# Altium project PV Refridgerator.PrjPCB (part 2 of 2)

## Sheet RGB LED.SchDoc: RGB LED
size Letter; Date: 2017-02-06; DocumentNumber: 16; Revision: A; SheetNumber: 16; SheetTotal: 16; DesignedBy: Craig Comberbach
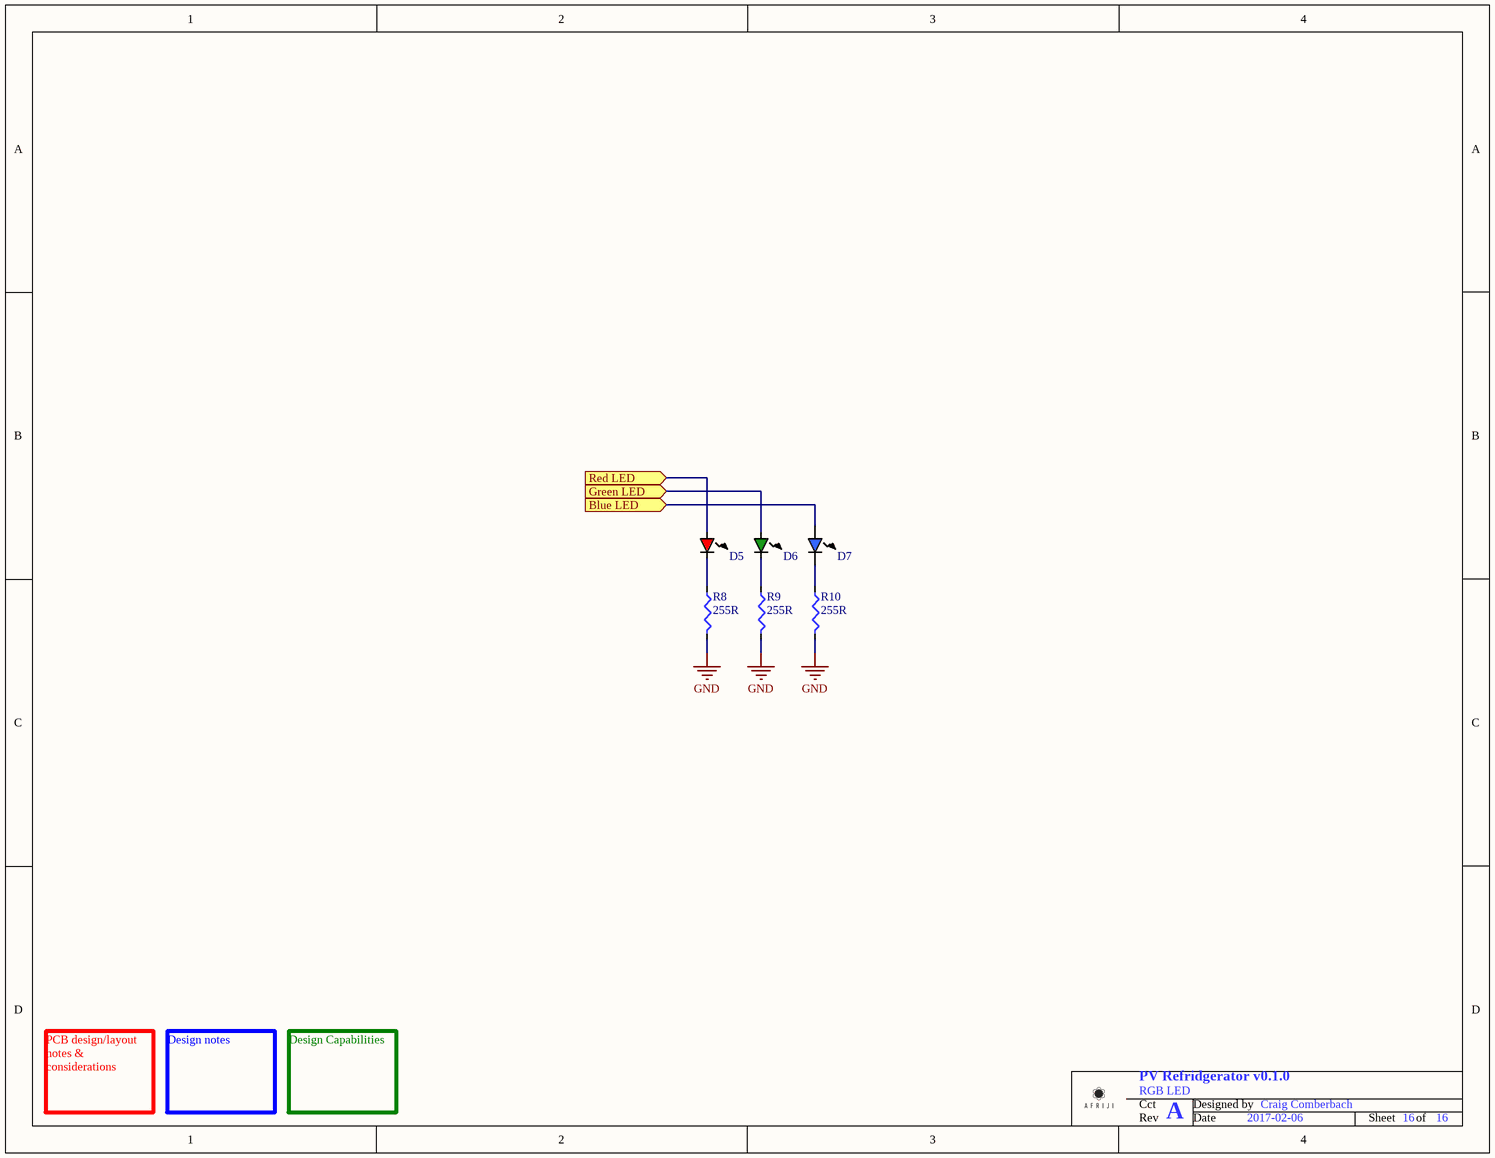
[diagram p8: RGB LED.SchDoc]

### Parts
D5  Red LED 1206  [LED - 1206 Red]  (value not drawn)
D6  Green LED 1206  [LED - 1206 Green]  (value not drawn)
D7  Blue LED 1206  [LED - 1206 Blue]  (value not drawn)
R8  Resistance (Ohms): 255R  [R0805]  (hidden comment: 255R 0805 1%)
R9  Resistance (Ohms): 255R  [R0805]  (hidden comment: 255R 0805 1%)
R10  Resistance (Ohms): 255R  [R0805]  (hidden comment: 255R 0805 1%)

### Ports
Blue LED (in), Green LED (in), Red LED (in)

### Nets
GND: R8.1 R9.1 R10.1
NetD5_1: D5.1 ; port Red LED
NetD5_2: D5.2 R8.2
NetD6_1: D6.1 ; port Green LED
NetD6_2: D6.2 R9.2
NetD7_1: D7.1 ; port Blue LED
NetD7_2: D7.2 R10.2

### Notes on the sheet
- PCB design/layout notes & considerations
- Design notes
- Design Capabilities
- Cct
- Designed by
- Rev
- Date
- Sheet
- of

### Library data of the parts
D5 = Red LED 1206: Manufacturer: Kingbright; Manufacturer Part Number: APT3216SRCPRV; Wavelength - Dominant: 640nm; Wavelength - Peak: 660nm; Millicandela Rating: 80mcd; Voltage - Forward (Vf) (Typ): 1.85V; Current - Test: 20mA; Viewing Angle: 120°; Lens Type: Clear; Lens Style/Size: Rectangle with Flat Top, 2mm x 1.6mm; Value: Red LED 1206; Supplier 1: Digi-Key; RoHS: RoHS Compliant; Category: Optoelectronics; Stock 1: 29504; Pricing 1: 1=0.2, 10=0.149, 25=0.1188, 100=0.1073, 250=0.099, 500=0.0891 (USD); Packaging: Cut Tape (CT); Color: Red; Package / Case: 1206 (3216 Metric); Size / Dimension: 3.20mm L x 1.60mm W; Height: 0.75mm; Mounting Type: Surface Mount; Luminous Flux @ Current - Test: -; ComponentLink1URL: http://www.kingbrightusa.com/images/catalog/SPEC/APT3216SRCPRV.pdf; ComponentLink1Description: Spec Sheet; Supplier Part Number 1: 754-1142-1-ND
D6 = Green LED 1206: Manufacturer: Kingbright; Manufacturer Part Number: APL3015SGC-F01; Wavelength - Dominant: 568nm; Wavelength - Peak: 565nm; Millicandela Rating: 20mcd; Voltage - Forward (Vf) (Typ): 2.2V; Current - Test: 20mA; Viewing Angle: 70°; Lens Type: Clear; Lens Style/Size: Rectangle with Flat Top, 2mm x 1.6mm; Value: Green LED 1206; Supplier 1: Digi-Key; Supplier Part Number 1: 754-1111-1-ND; RoHS: RoHS Compliant; Category: Optoelectronics; Stock 1: 31522; Pricing 1: 1=0.21, 10=0.156, 25=0.1248, 100=0.1127, 250=0.104, 500=0.09362 (CAD); Packaging: Cut Tape (CT); Color: Green; Package / Case: 2-SMD, No Lead; Size / Dimension: 3.00mm L x 1.50mm W; Height: 1.40mm; Mounting Type: Surface Mount; Luminous Flux @ Current - Test: -; ComponentLink1URL: http://www.kingbrightusa.com/images/catalog/SPEC/APL3015SGC-F01.pdf; ComponentLink1Description: Spec Sheet
D7 = Blue LED 1206: Single Colour; Manufacturer: Lite-On Inc; Manufacturer Part Number: LTST-C150TBKT; Wavelength - Dominant: 470nm; Wavelength - Peak: 468nm; Millicandela Rating: 104mcd; Voltage - Forward (Vf) (Typ): 3.3V; Current - Test: 20mA; Viewing Angle: 130°; Lens Transparency: Clear; Lens Color: Colorless; Lens Style/Size: Rectangle with Flat Top, 2.06mm x 1.60mm; Value: Blue LED 1206; Supplier 1: Digi-Key; RoHS: RoHS Compliant; Category: Optoelectronics; Stock 1: 185598; Pricing 1: 1=0.65, 10=0.485, 100=0.2567, 250=0.1816, 500=0.15498, 1000=0.12108 (CAD); Packaging: Cut Tape (CT); Color: Blue; Package / Case: 1206 (3216 Metric); Supplier Device Package: 1206; Size / Dimension: 3.20mm L x 1.60mm W; Height (Max): 1.10mm; Mounting Type: Surface Mount; ComponentLink1URL: http://optoelectronics.liteon.com/upload/download/DS22-2000-026/S_110_LTST-C150TBKT(0630).pdf; ComponentLink1Description: Spec Sheet; Supplier Part Number 1: 160-1643-1-ND
R8-R10 = 255R 0805 1%: 1/8W; Manufacturer P/N: ERJ-6ENF2550V; Manufacturer: Panasonic Electronic Components; Vendor: Digi-Key; Vendor P/N: P255CCT-ND; Power (Watts): 0.125W, 1/8W; Temperature Coefficient: ±100ppm/°C; Technology: SMT; Value: 255R 0805 1%; Package: 0805; Ptolerance: 1%; Supplier 1: Digi-Key; Supplier Part Number 1: P255CCT-ND; Manufacturer Part Number: ERJ-6ENF2550V; RoHS: RoHS Compliant; Category: Resistors; Stock 1: 94483; Pricing 1: 1=0.12, 50=0.0354, 100=0.027, 250=0.02, 500=0.01476, 1000=0.00985, 2500=0.00831 (CAD); Packaging: Cut Tape (CT); Tolerance: ±1%; Composition: Thick Film; Features: -; Package / Case: 0805 (2012 Metric); Supplier Device Package: 0805; Size / Dimension: 0.079" L x 0.049" W (2.00mm x 1.25mm); Height: 0.028" (0.70mm); Number of Terminations: 2; ComponentLink1URL: http://industrial.panasonic.com/www-cgi/jvcr13pz.cgi?E+PZ+3+AOA0002+ERJ6ENF2550V+7+WW; ComponentLink1Description: Spec Sheet

## Sheet 15VDC Powersupply.SchDoc: 3.3VDC Powersupply
size Letter; Date: 2017-02-04; DocumentNumber: 8; Revision: A; SheetNumber: 8; SheetTotal: 16; DesignedBy: Craig Comberbach
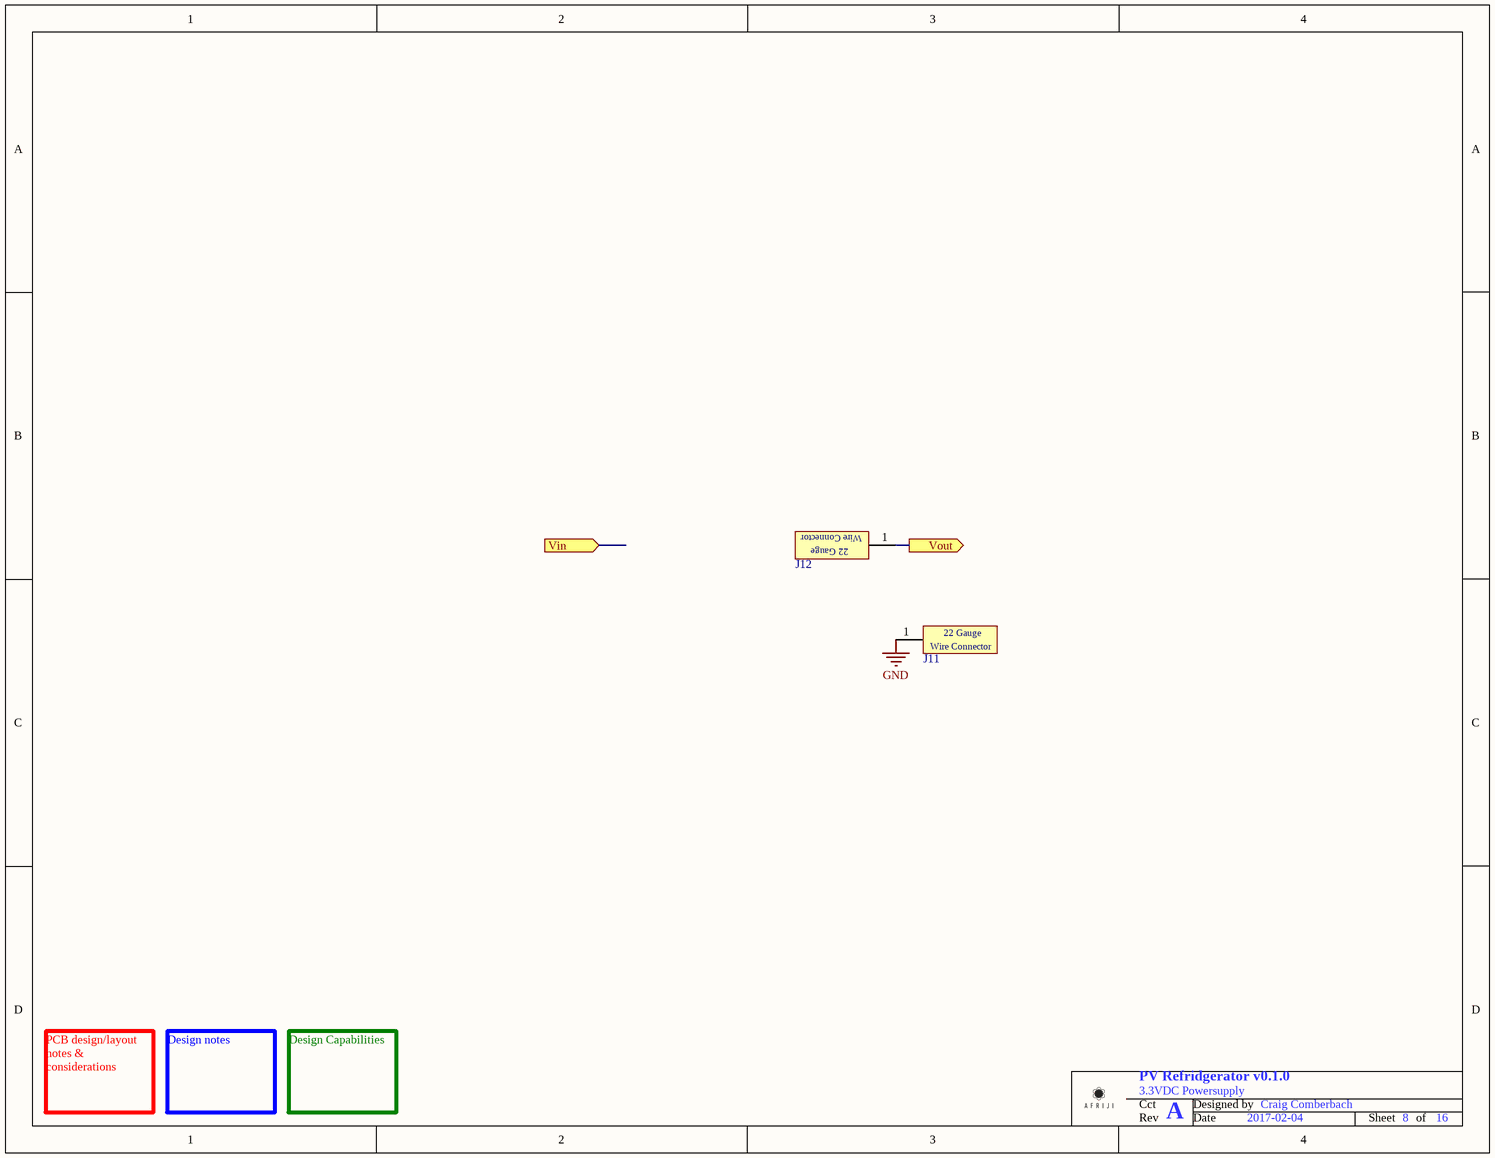
[diagram p9: 15VDC Powersupply.SchDoc]

### Parts
J11  1 Pin 22-Gauge Wire connector  [1 Pin 22-Gauge Wire Connector]  (value not drawn)  (no BOM)
J12  1 Pin 22-Gauge Wire connector  [1 Pin 22-Gauge Wire Connector]  (value not drawn)  (no BOM)

### Ports
Vin (in), Vout (out)

### Nets
15VDC: J12.1 ; port Vout
GND: J11.1

### Notes on the sheet
- PCB design/layout notes & considerations
- Design notes
- Design Capabilities
- Cct
- Designed by
- Rev
- Date
- Sheet
- of
- (in symbol 1 Pin 22-Gauge Wire connector) 22 Gauge; Wire Connector

## Sheet Vsense Thermistor.SchDoc: Vsense from 0 to 223.3V
size Letter; Date: 2017-02-08; DocumentNumber: 14; Revision: A; SheetNumber: 14; SheetTotal: 16; DesignedBy: Mike MacKay
Used 5 times, as channels Vsense Thermistor, Vsense Thermistor, Vsense Thermistor, Vsense Thermistor, Vsense Thermistor. Parts and nets are listed once, with the designators drawn on the sheet.
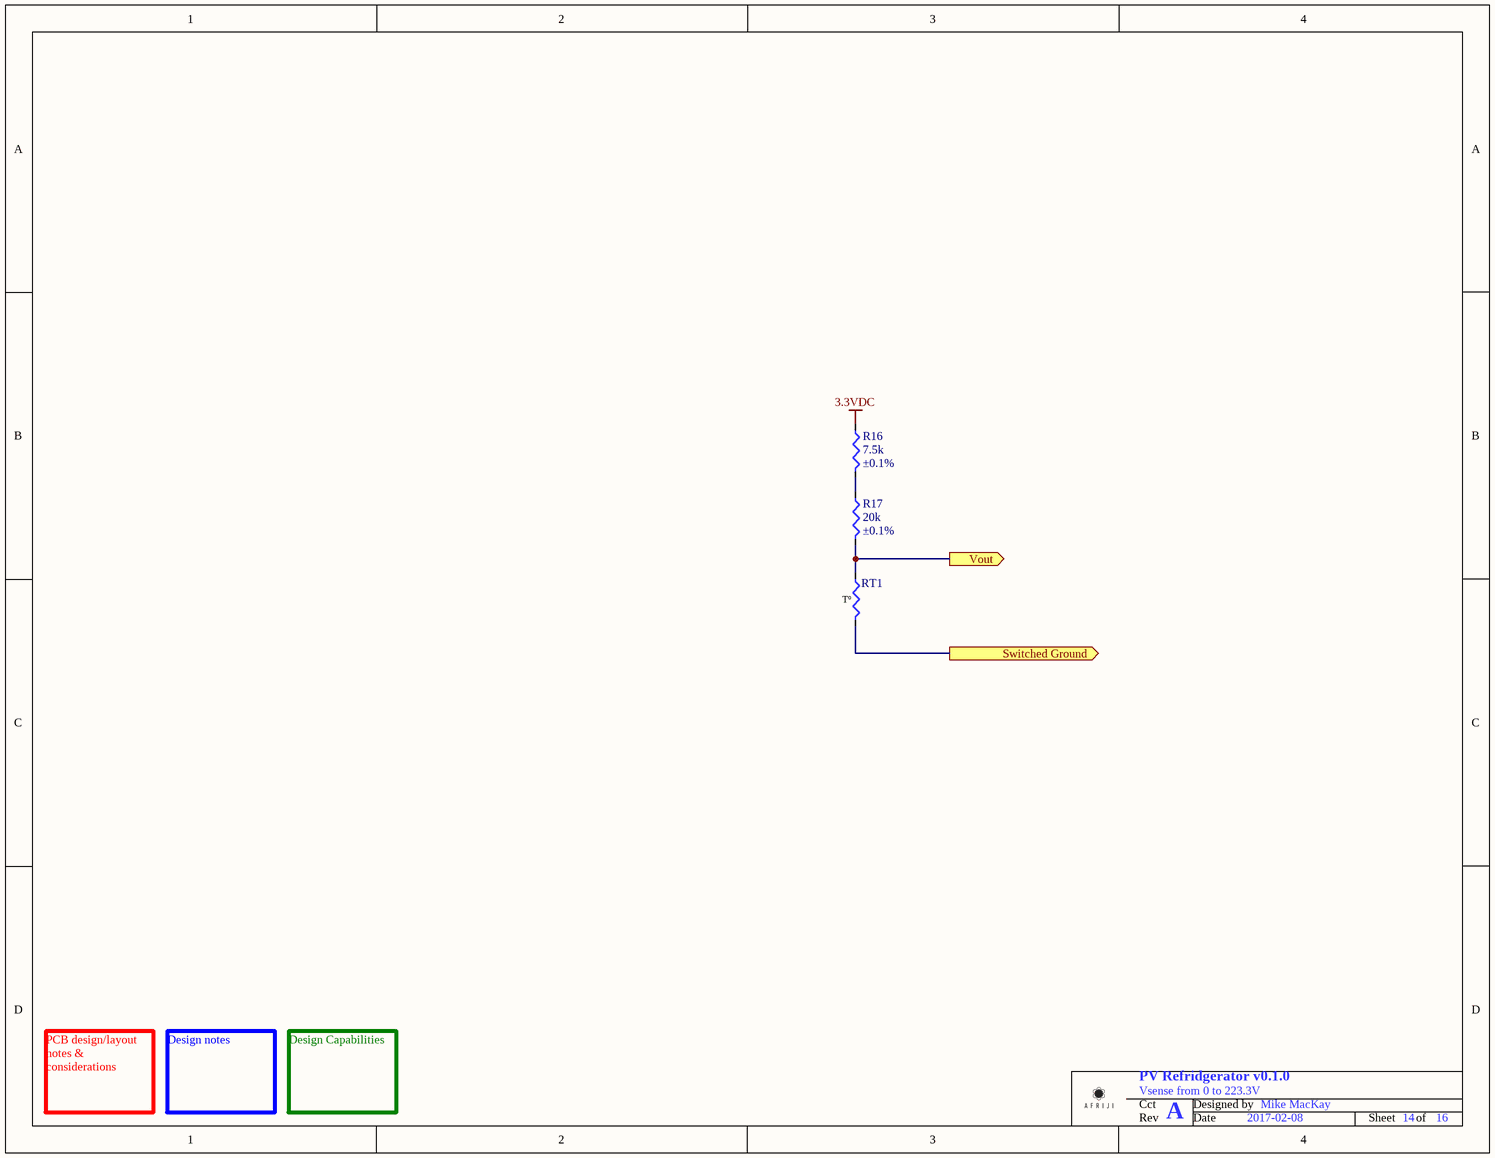
[diagram p10: Vsense Thermistor.SchDoc]

### Parts
R16  Resistance (Ohms): 7.5k  Tolerance: ±0.1%  [R0603]  (hidden comment: Template - Resistor)
R17  Resistance (Ohms): 20k  Tolerance: ±0.1%  [R0603]  (hidden comment: Template - Resistor)
RT1  Tº  [Connector - MTA-100 2 Position Friction Lock]  (value not drawn)

### Ports
Switched Ground (out), Vout (out)

### Nets
3.3VDC: R16.2
Switched Ground: RT1.1 ; port Switched Ground
Vout: R17.1 RT1.2 ; port Vout
NetR16_1: R16.1 R17.2

### Channels
Vsense Thermistor: designators end in A; ports Switched Ground=Switched Ground 1 Vout=Vtemp 1
Vsense Thermistor: designators end in B; ports Switched Ground=Switched Ground 2 Vout=Vtemp 2
Vsense Thermistor: designators end in C; ports Switched Ground=Switched Ground 3 Vout=Vtemp 3
Vsense Thermistor: designators end in D; ports Switched Ground=Switched Ground 4 Vout=Vtemp 4
Vsense Thermistor: designators end in E; ports Switched Ground=Switched Ground 5 Vout=Vtemp 5

### Notes on the sheet
- PCB design/layout notes & considerations
- Design notes
- Design Capabilities
- Cct
- Designed by
- Rev
- Date
- Sheet
- of

### Library data of the parts
R16 = Template - Resistor: Resistor; Manufacturer: Yageo; Manufacturer Part Number: RT0603BRD077K5L; Value: 7.5k 0603 0.1%; Power (Watts): 0.1W, 1/10W; Temperature Coefficient: ±25ppm/°C; Technology: SMT; Supplier 1: Digi-Key; Supplier Part Number 1: YAG2311CT-ND; RoHS: RoHS Compliant; Category: Resistors; Stock 1: 15357; Pricing 1: 1=0.32, 10=0.269, 25=0.1952, 50=0.1416, 100=0.105, 250=0.0806, 500=0.0635, 1000=0.04396 (USD); Packaging: Cut Tape (CT); Part Status: Active; Composition: Thin Film; Features: Moisture Resistant; Operating Temperature: -55°C ~ 155°C; Package / Case: 0603 (1608 Metric); Supplier Device Package: 0603; Size / Dimension: 0.063" L x 0.031" W (1.60mm x 0.80mm); Height - Seated (Max): 0.022" (0.55mm); Number of Terminations: 2; Failure Rate: -; ComponentLink1URL: http://www.yageo.com/documents/recent/PYu-RT_1-to-0.05_RoHS_L_7.pdf; ComponentLink1Description: Spec Sheet
R17 = Template - Resistor: Resistor; Manufacturer: Yageo; Manufacturer Part Number: RT0603BRD0720KL; Power (Watts): 0.1W, 1/10W; Temperature Coefficient: ±25ppm/°C; Technology: SMT; Supplier 1: Digi-Key; Supplier Part Number 1: YAG1582CT-ND; RoHS: RoHS Compliant; Category: Resistors; Stock 1: 24543; Pricing 1: 1=0.35, 10=0.297, 25=0.216, 50=0.1566, 100=0.1161, 250=0.08912, 500=0.0702, 1000=0.0486 (USD); Packaging: Cut Tape (CT); Part Status: Active; Composition: Thin Film; Features: Moisture Resistant; Operating Temperature: -55°C ~ 155°C; Package / Case: 0603 (1608 Metric); Supplier Device Package: 0603; Size / Dimension: 0.063" L x 0.031" W (1.60mm x 0.80mm); Height - Seated (Max): 0.022" (0.55mm); Number of Terminations: 2; Failure Rate: -; ComponentLink1URL: http://www.yageo.com/documents/recent/PYu-RT_1-to-0.05_RoHS_L_7.pdf; ComponentLink1Description: Spec Sheet
RT1 = Thermistor 10k Type J: Resistor; Manufacturer: Murata Electronics North America; Manufacturer Part Number: NXFT15XH103FA2B025; Resistance in Ohms @ 25°C: 10k; Resistance Tolerance: ±1%; B25/50: 3380K; B25/85: 3434K; B25/100: 3455K; Power - Max: 100mW; Technology: THT; Value: Thermistor 10k; Supplier 1: Digi-Key; Supplier Part Number 1: 490-5628-ND; RoHS: RoHS Compliant; Category: Sensors, Transducers; Stock 1: 21226; Pricing 1: 1=0.91, 10=0.752, 25=0.6608, 50=0.549, 100=0.4676, 250=0.42692, 500=0.4066, 1000=0.35578, 2500=0.34053 (USD); Packaging: Bulk; Part Status: Active; B Value Tolerance: ±1%; B0/50: -; B25/75: -; Operating Temperature: -40°C ~ 125°C; Length - Lead Wire: -; Mounting Type: Free Hanging; Package / Case: Bead; ComponentLink1URL: http://www.murata.com/~/media/webrenewal/support/library/catalog/products/thermistor/ntc/r44e.ashx; ComponentLink1Description: Spec Sheet

## Sheet Current Sense.SchDoc: Vsense from 0 to 69.3V
size Letter; Date: 2017-02-08; DocumentNumber: 15; Revision: A; SheetNumber: 15; SheetTotal: 16; DesignedBy: Mike MacKay
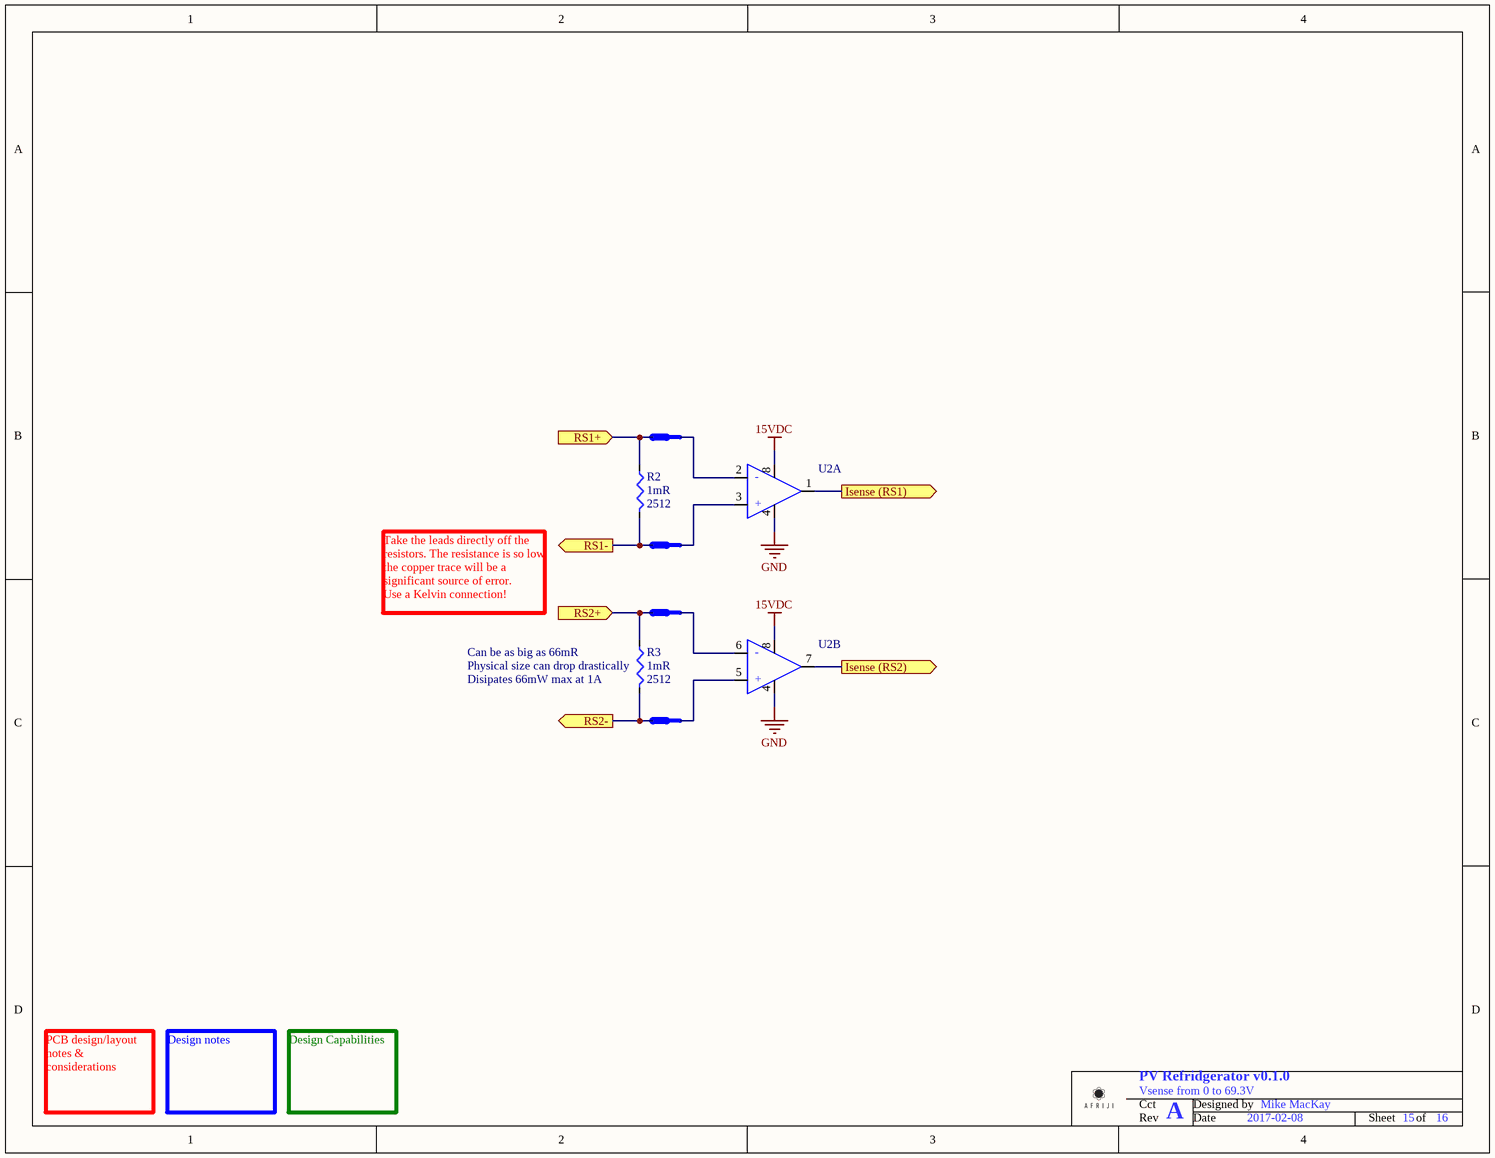
[diagram p11: Current Sense.SchDoc]

### Parts
(Parts that share a designator on the sheet are numbered #1, #2 ... from top to bottom, then left to right.)
NetTie3#2  Net Tie  [Net tie (7/35 mil)]  (value not drawn)  (net tie, no BOM)
NetTie4  Net Tie  [Net tie (7/7 mil)]  (value not drawn)  (net tie, no BOM)
NetTie5  Net Tie  [Net tie (7/35 mil)]  (value not drawn)  (net tie, no BOM)
NetTie6  Net Tie  [Net tie (7/7 mil)]  (value not drawn)  (net tie, no BOM)
R2  Resistance (Ohms): 1mR  Package / Case: 2512  [R2512]  (hidden comment: Template - Resistor)
R3  Note1: Can be as big as 66mR  Note2: Physical size can drop drastically  Note3: Disipates 66mW max at 1A  Resistance (Ohms): 1mR  Package / Case: 2512  [R2512]
U2  Dual High Side Current Sense Amplifier  [SOIC-8 (3.9mm)]  (value not drawn)  (parts A,B of 2)

### Ports
Isense (RS1) (out), Isense (RS2) (out), RS1+ (in), RS1- (out), RS2+ (in), RS2- (out)

### Nets
15VDC: U2.8(VCC)
GND: U2.4(GND)
-DC Bus: NetTie6.2 R3.1 ; port RS2-
NetNetTie3#2_1: NetTie3#2.1 U2.2(RS1-)
NetNetTie3#2_2: NetTie3#2.2 R2.2 ; port RS1+
NetNetTie4_1: NetTie4.1 U2.3(RS1+)
NetNetTie4_2: NetTie4.2 R2.1 ; port RS1-
NetNetTie5_1: NetTie5.1 U2.6(RS2-)
NetNetTie5_2: NetTie5.2 R3.2 ; port RS2+
NetNetTie6_1: NetTie6.1 U2.5(RS2+)
NetU1_22: U2.1(Out) ; port Isense (RS1)
NetU1_23: U2.7(OUT2) ; port Isense (RS2)

### Notes on the sheet
- Take the leads directly off the resistors. The resistance is so low the copper trace will be a significant source of error.
  Use a Kelvin connection!
- PCB design/layout notes & considerations
- Design notes
- Design Capabilities
- Cct
- Designed by
- Rev
- Date
- Sheet
- of
- (in symbol Dual High Side Current Sense Amplifier, part A) +
- (in symbol Dual High Side Current Sense Amplifier, part B) +

### Library data of the parts
NetTie3#2 NetTie4-NetTie6 = Net Tie: Ties two nets together
R2 = Template - Resistor: Manufacturer: Yageo; Manufacturer Part Number: PR2512FKG070R001L; Value: 1mR 2512 1%; Tolerance: ±1%; Power (Watts): 1W; Temperature Coefficient: ±200ppm/°C; Supplier 1: Digi-Key; Supplier Part Number 1: 311-0.001AGCT-ND; RoHS: RoHS Compliant; Category: Resistors; Stock 1: 24788; Pricing 1: 1=0.86, 10=0.749, 25=0.6588, 50=0.6018, 100=0.5224, 250=0.45424, 500=0.377, 1000=0.3066 (USD); Packaging: Cut Tape (CT); Part Status: Active; Composition: Thick Film; Features: Current Sense; Operating Temperature: -55°C ~ 170°C; Supplier Device Package: 2512; Size / Dimension: 0.252" L x 0.126" W (6.40mm x 3.20mm); Height - Seated (Max): 0.041" (1.03mm); Number of Terminations: 2; Failure Rate: -; ComponentLink1URL: http://www.yageo.com/NewPortal/yageodocoutput?fileName=/pdf/R-Chip/-PYu-PR_51_RoHS_Z_0.pdf; ComponentLink1Description: Spec Sheet
R3 = Template - Resistor: Manufacturer: Yageo; Manufacturer Part Number: PR2512FKG070R001L; Tolerance: ±1%; Power (Watts): 1W; Temperature Coefficient: ±200ppm/°C; Supplier 1: Digi-Key; Supplier Part Number 1: 311-0.001AGCT-ND; RoHS: RoHS Compliant; Category: Resistors; Stock 1: 24782; Pricing 1: 1=0.86, 10=0.749, 25=0.6588, 50=0.6018, 100=0.5224, 250=0.45424, 500=0.377, 1000=0.3066 (USD); Packaging: Cut Tape (CT); Part Status: Active; Composition: Thick Film; Features: Current Sense; Operating Temperature: -55°C ~ 170°C; Supplier Device Package: 2512; Size / Dimension: 0.252" L x 0.126" W (6.40mm x 3.20mm); Height - Seated (Max): 0.041" (1.03mm); Number of Terminations: 2; Failure Rate: -; ComponentLink1URL: http://www.yageo.com/NewPortal/yageodocoutput?fileName=/pdf/R-Chip/-PYu-PR_51_RoHS_Z_0.pdf; ComponentLink1Description: Spec Sheet
U2 = Dual High Side Current Sense Amplifier: Manufacturer: Maxim Integrated; Manufacturer Part Number: MAX4377FASA+; Number of Circuits: 2; Slew Rate: 10 V/µs; -3db Bandwidth: 1.7MHz; Current - Input Bias: 800µA; Current - Supply: 1mA; Voltage - Supply, Single/Dual (±): 3 V ~ 28 V; Supplier 1: Digi-Key; RoHS: RoHS Compliant; Category: Integrated Circuits (ICs); Stock 1: 695; Pricing 1: 1=1.98, 10=1.881, 50=1.8742 (USD); Packaging: Tube; Part Status: Active; Amplifier Type: Current Sense; Output Type: -; Gain Bandwidth Product: -; Voltage - Input Offset: -; Current - Output / Channel: -; Operating Temperature: -40°C ~ 125°C; Mounting Type: Surface Mount; Package / Case: 8-SOIC (0.154", 3.90mm Width); Supplier Device Package: 8-SOIC; ComponentLink1URL: https://datasheets.maximintegrated.com/en/ds/MAX4376-MAX4378.pdf; ComponentLink1Description: Spec Sheet; Supplier Part Number 1: MAX4377FASA+-ND

## Sheet Safety Logic.SchDoc: Safety Logic
size Letter; Date: 2017-02-10; DocumentNumber: 4; Revision: A; SheetNumber: 4; SheetTotal: 16; DesignedBy: Mike MacKay
Used 2 times, as channels Safety Logic, Safety Logic. Parts and nets are listed once, with the designators drawn on the sheet.
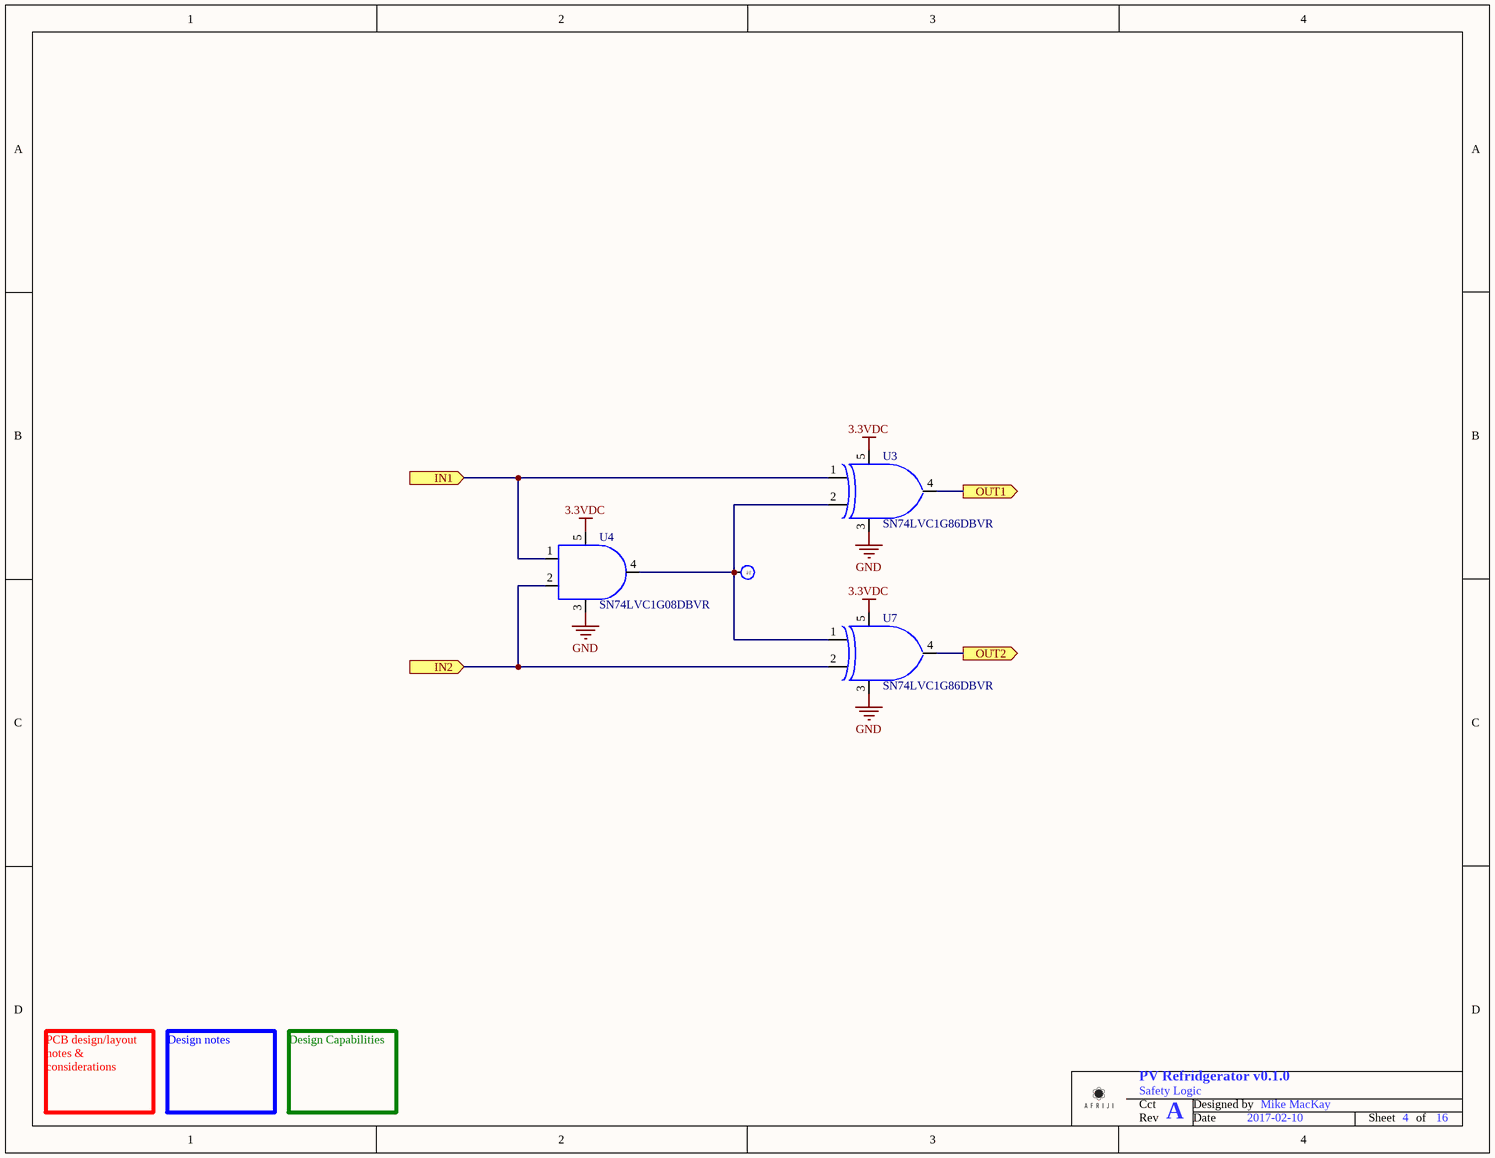
[diagram p12: Safety Logic.SchDoc]

### Parts
TP4  Test Clip  [SMT Test Clip]  (value not drawn)
U3  Manufacturer Part Number: SN74LVC1G86DBVR  [SOT23-5]  (hidden comment: Single XOR Logic Gate)
U4  Manufacturer Part Number: SN74LVC1G08DBVR  [SOT23-5]  (hidden comment: Single AND Logic Gate)
U7  Manufacturer Part Number: SN74LVC1G86DBVR  [SOT23-5]  (hidden comment: Single XOR Logic Gate)

### Ports
IN1 (in), IN2 (in), OUT1 (out), OUT2 (out)

### Nets
3.3VDC: U3.5(Vcc) U4.5(Vcc) U7.5(Vcc)
GND: U3.3(Gnd) U4.3(Gnd) U7.3(Gnd)
IN1: U3.1(A) U4.1(A) ; port IN1
IN2: U4.2(B) U7.2(B) ; port IN2
OUT1: U3.4(Y) ; port OUT1
OUT2: U7.4(Y) ; port OUT2
NetTP4_1: TP4.1 U3.2(B) U4.4(Y) U7.1(A)

### Channels
Safety Logic: designators end in A; ports IN1=NetU1_52 IN2=NetU1_53 OUT1=NetU3A_4 OUT2=NetU7A_4
Safety Logic: designators end in B; ports IN1=NetU1_4 IN2=NetU1_5 OUT1=NetU3B_4 OUT2=NetU6B_1

### Notes on the sheet
- PCB design/layout notes & considerations
- Design notes
- Design Capabilities
- Cct
- Designed by
- Rev
- Date
- Sheet
- of
- (in symbol Test Clip) Clip; Test

### Library data of the parts
TP4 = Test Clip: Manufacturer: TE Connectivity AMP Connectors; Manufacturer Part Number: RCU-0C; Value: SMT Test Clip; Material - Insulation: No Insulation; Technology: SMT; Supplier 1: Digi-Key; RoHS: RoHS Compliant; Category: Test and Measurement; Stock 1: 58926; Pricing 1: 1=0.31, 10=0.291, 25=0.248, 50=0.217, 100=0.2014, 250=0.1782, 500=0.17046, 1000=0.13947 (CAD); Packaging: Cut Tape (CT); Part Status: Active; Type: PC Test Point; Mounting Type: Surface Mount; Color: Natural; Size / Dimension: 0.063" x 0.031" x 0.045" (1.60mm x 0.80mm x 1.15mm); Plating: -; Material - Body: -; ComponentLink1URL: http://www.te.com/commerce/DocumentDelivery/DDEController?Action=srchrtrv&DocNm=1773266&DocType=DS&DocLang=English; ComponentLink1Description: Spec Sheet; Supplier Part Number 1: A106145CT-ND
U3 U7 = Single XOR Logic Gate: Manufacturer: Texas Instruments; Logic Type: XOR (Exclusive OR); Number of Circuits: 1; Number of Inputs: 2; Voltage - Supply: 1.65 V ~ 5.5 V; Current - Quiescent (Max): 10µA; Current - Output High, Low: 32mA, 32mA; Logic Level - Low: 0.7 V ~ 0.8 V; Logic Level - High: 1.7 V ~ 2 V; Max Propagation Delay @ V, Max CL: 4ns @ 5V, 50pF; Supplier 1: Digi-Key; RoHS: RoHS Compliant; Category: Integrated Circuits (ICs); Stock 1: 19977; Pricing 1: 1=0.36, 10=0.29, 100=0.198, 500=0.1482, 1000=0.111 (USD); Packaging: Cut Tape (CT); Part Status: Active; Features: -; Operating Temperature: -40°C ~ 125°C; Mounting Type: Surface Mount; Supplier Device Package: SOT-23-5; Package / Case: SC-74A, SOT-753; ComponentLink1URL: http://www.ti.com/lit/ds/symlink/sn74lvc1g86.pdf; ComponentLink1Description: Spec Sheet; Supplier Part Number 1: 296-9853-1-ND
U4 = Single AND Logic Gate: Manufacturer: Texas Instruments; Logic Type: AND Gate; Number of Circuits: 1; Number of Inputs: 2; Voltage - Supply: 1.65 V ~ 5.5 V; Current - Quiescent (Max): 10µA; Current - Output High, Low: 32mA, 32mA; Max Propagation Delay @ V, Max CL: 4ns @ 5V, 50pF; Value: Single AND Logic Gate; Supplier 1: Digi-Key; Supplier Part Number 1: 296-11601-1-ND; RoHS: RoHS Compliant; Category: Integrated Circuits (ICs); Stock 1: 17122; Pricing 1: 1=0.42, 10=0.315, 100=0.196, 500=0.134, 1000=0.103 (USD); Packaging: Cut Tape (CT); Part Status: Active; Features: -; Logic Level - Low: -; Logic Level - High: -; Operating Temperature: -40°C ~ 125°C; Mounting Type: Surface Mount; Supplier Device Package: SOT-23-5; Package / Case: SC-74A, SOT-753; ComponentLink1URL: http://www.ti.com/lit/ds/symlink/sn74lvc1g08.pdf; ComponentLink1Description: Spec Sheet

## Nets that join several sheets
3.3VDC: 3.3VDC Powersupply (C12.1 U5.3), Microcontroller (9 pins), ICSP (J4.5 J5.2 R4.1), Vsense Thermistor (R16A.2), Safety Logic (U3A.5 U4A.5 U7A.5), Safety Logic (U3B.5 U4B.5 U7B.5), Vsense Thermistor (R16B.2), Vsense Thermistor (R16C.2), Vsense Thermistor (R16D.2), Vsense Thermistor (R16E.2)
15VDC: High Voltage H-Bridge/Half H-Bridge Driver (C13A.1 D8A.1 U6A.5), High Voltage H-Bridge/Half H-Bridge Driver (C13B.1 D8B.1 U6B.5), 15VDC Powersupply (J12.1), Current Sense (U2.8)
GND: Overview (NetTie2.1 NetTie3#1.2), High Voltage H-Bridge/Half H-Bridge Driver (C13A.2 U6A.3), High Voltage H-Bridge/Half H-Bridge Driver (C13B.2 U6B.3), 3.3VDC Powersupply (C11.2 C12.2 J9.1 U5.2), Microcontroller (10 pins), ICSP (J4.4 J5.3), RGB LED (R8.1 R9.1 R10.1), 15VDC Powersupply (J11.1), Current Sense (U2.4), Safety Logic (U3A.3 U4A.3 U7A.3), Safety Logic (U3B.3 U4B.3 U7B.3)
HVGND: Overview (NetTie3#1.1), Full-Wave Rectifier (D2.1 D4.2), Transformer (J8.1 T1.1)
+DC Bus: Full-Wave Rectifier (C9.2 C10.2 D1.2 D2.2), High Voltage H-Bridge (Q5.3 Q6.3)
+VT1.P: Overview (NetTie8.2), Transformer (J7.2 T1.8 T1.12)
+VT1.S: Full-Wave Rectifier (D1.1 D3.2), Transformer (J8.2 T1.6)
-DC Bus: Full-Wave Rectifier (C9.1 C10.1 D3.1 D4.1), Current Sense (NetTie6.2 R3.1)
-VT1.P: Overview (NetTie9.2), Transformer (J7.1 T1.7 T1.11)
C_HO: High Voltage H-Bridge (Q5.1), High Voltage H-Bridge/Half H-Bridge Driver (R12A.2)
C_LO: High Voltage H-Bridge (Q8.1), High Voltage H-Bridge/Half H-Bridge Driver (R13A.2)
C_VS: Overview (J6.1), High Voltage H-Bridge (C2.1 C3.1 Q5.2 Q7.3), High Voltage H-Bridge/Half H-Bridge Driver (NetTie1A.2)
D_HO: High Voltage H-Bridge (Q6.1), High Voltage H-Bridge/Half H-Bridge Driver (R12B.2)
D_LO: High Voltage H-Bridge (Q7.1), High Voltage H-Bridge/Half H-Bridge Driver (R13B.2)
D_VS: Overview (J6.2), High Voltage H-Bridge (C2.2 C3.2 Q6.2 Q8.3), High Voltage H-Bridge/Half H-Bridge Driver (NetTie1B.2)
MCLR: Microcontroller (U1.7), ICSP (R5.2)
NetD5_1: Microcontroller (U1.43), RGB LED (D5.1)
NetD6_1: Microcontroller (U1.44), RGB LED (D6.1)
NetD7_1: Microcontroller (U1.45), RGB LED (D7.1)
NetNetTie5_2: High Voltage H-Bridge (Q7.2 Q8.2), Current Sense (NetTie5.2 R3.2)
NetU1_4: Microcontroller (U1.4), Safety Logic (U3B.1 U4B.1)
NetU1_5: Microcontroller (U1.5), Safety Logic (U4B.2 U7B.2)
NetU1_22: Microcontroller (U1.22), Current Sense (U2.1)
NetU1_23: Microcontroller (U1.23), Current Sense (U2.7)
NetU1_52: Microcontroller (U1.52), Safety Logic (U3A.1 U4A.1)
NetU1_53: Microcontroller (U1.53), Safety Logic (U4A.2 U7A.2)
NetU3B_4: High Voltage H-Bridge/Half H-Bridge Driver (U6A.1 U6A.2), Safety Logic (U3B.4)
NetU6B_1: High Voltage H-Bridge/Half H-Bridge Driver (U6B.1 U6B.2), Safety Logic (U7B.4)
PGC: Microcontroller (U1.11), ICSP (R7.2)
PGD: Microcontroller (U1.12), ICSP (R6.2)
Switched Ground 1: Microcontroller (U1.34), Vsense Thermistor (RT1A.1)
Switched Ground 2: Microcontroller (U1.33), Vsense Thermistor (RT1B.1)
Switched Ground 3: Microcontroller (U1.35), Vsense Thermistor (RT1C.1)
Switched Ground 4: Microcontroller (U1.31), Vsense Thermistor (RT1D.1)
Switched Ground 5: Microcontroller (U1.32), Vsense Thermistor (RT1E.1)
Vtemp 1: Microcontroller (U1.17), Vsense Thermistor (R17A.1 RT1A.2)
Vtemp 2: Microcontroller (U1.13), Vsense Thermistor (R17B.1 RT1B.2)
Vtemp 3: Microcontroller (U1.18), Vsense Thermistor (R17C.1 RT1C.2)
Vtemp 4: Microcontroller (U1.21), Vsense Thermistor (R17D.1 RT1D.2)
Vtemp 5: Microcontroller (U1.24), Vsense Thermistor (R17E.1 RT1E.2)